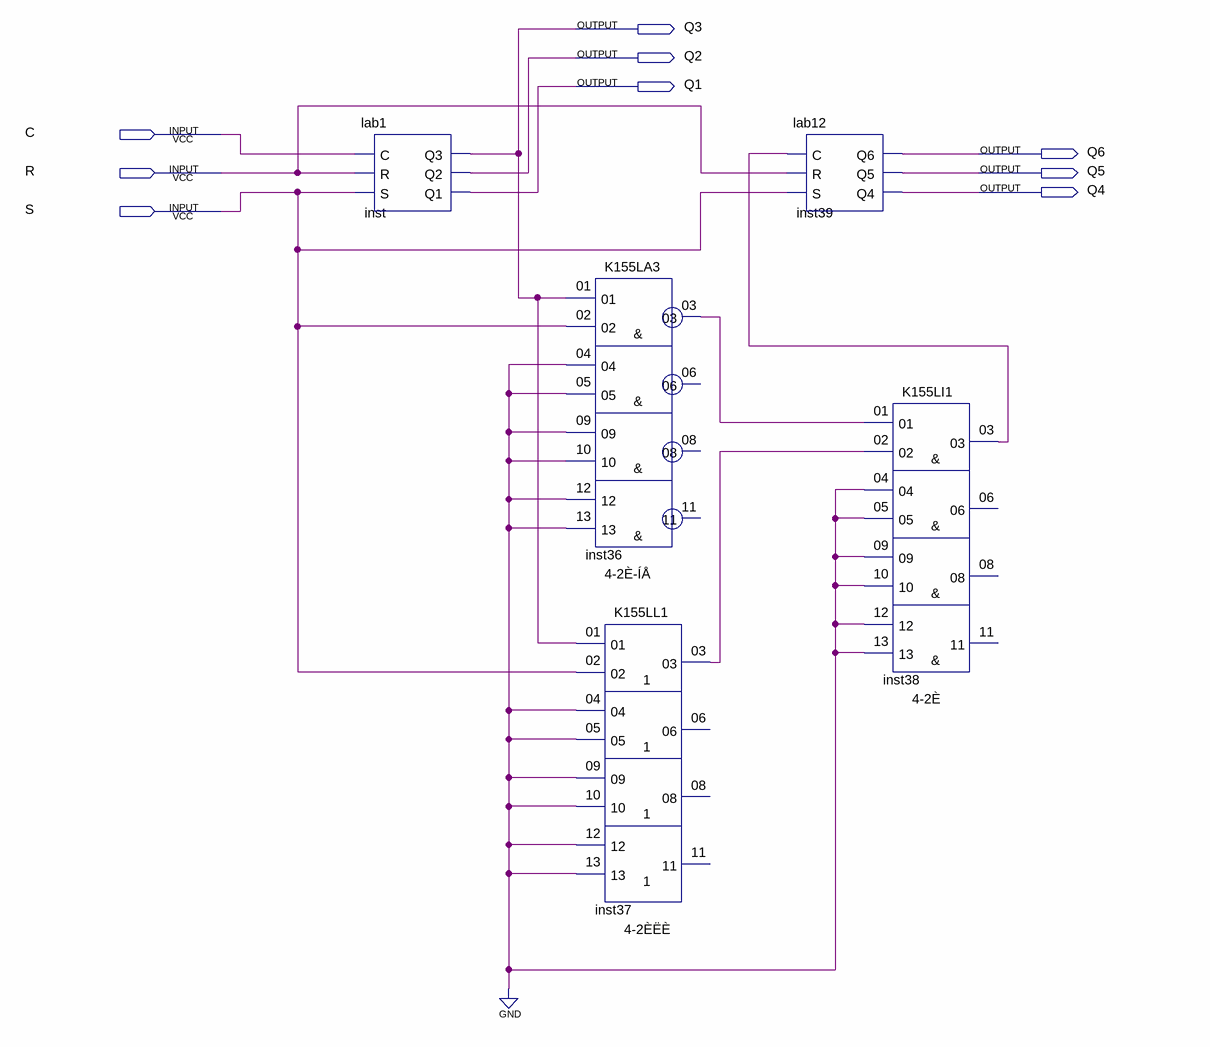
[diagram p0: schematic sheet]
// Quartus schematic lab13.bdf as structural Verilog: 5 symbols, 9 pins
module lab13 (
  input  C,
  input  R,
  input  S,
  output Q3,
  output Q2,
  output Q1,
  output Q6,
  output Q5,
  output Q4
);

  wire inst36_03, inst37_03, inst38_03;

  lab1 inst (.C(C), .R(R), .S(S), .Q3(Q3), .Q2(Q2), .Q1(Q1));
  K155LA3 inst36 (
    .\01 (Q3), .\02 (S), .\04 (1'b0), .\05 (1'b0), .\09 (1'b0), .\10 (1'b0), .\12 (1'b0), .\13 (1'b0),
    .\03 (inst36_03));  // open: 06, 08, 11
  K155LL1 inst37 (
    .\01 (Q3), .\02 (S), .\04 (1'b0), .\05 (1'b0), .\09 (1'b0), .\10 (1'b0), .\12 (1'b0), .\13 (1'b0),
    .\03 (inst37_03));  // open: 06, 08, 11
  lab12 inst39 (.C(inst38_03), .R(R), .S(S), .Q6(Q6), .Q5(Q5), .Q4(Q4));
  K155LI1 inst38 (
    .\01 (inst36_03), .\02 (inst37_03), .\04 (1'b0), .\05 (1'b0), .\09 (1'b0), .\10 (1'b0), .\12 (1'b0),
    .\13 (1'b0), .\03 (inst38_03));  // open: 06, 08, 11
endmodule
